# EAGLE schematic AirDistMotor (EAGLE 7.5.0)
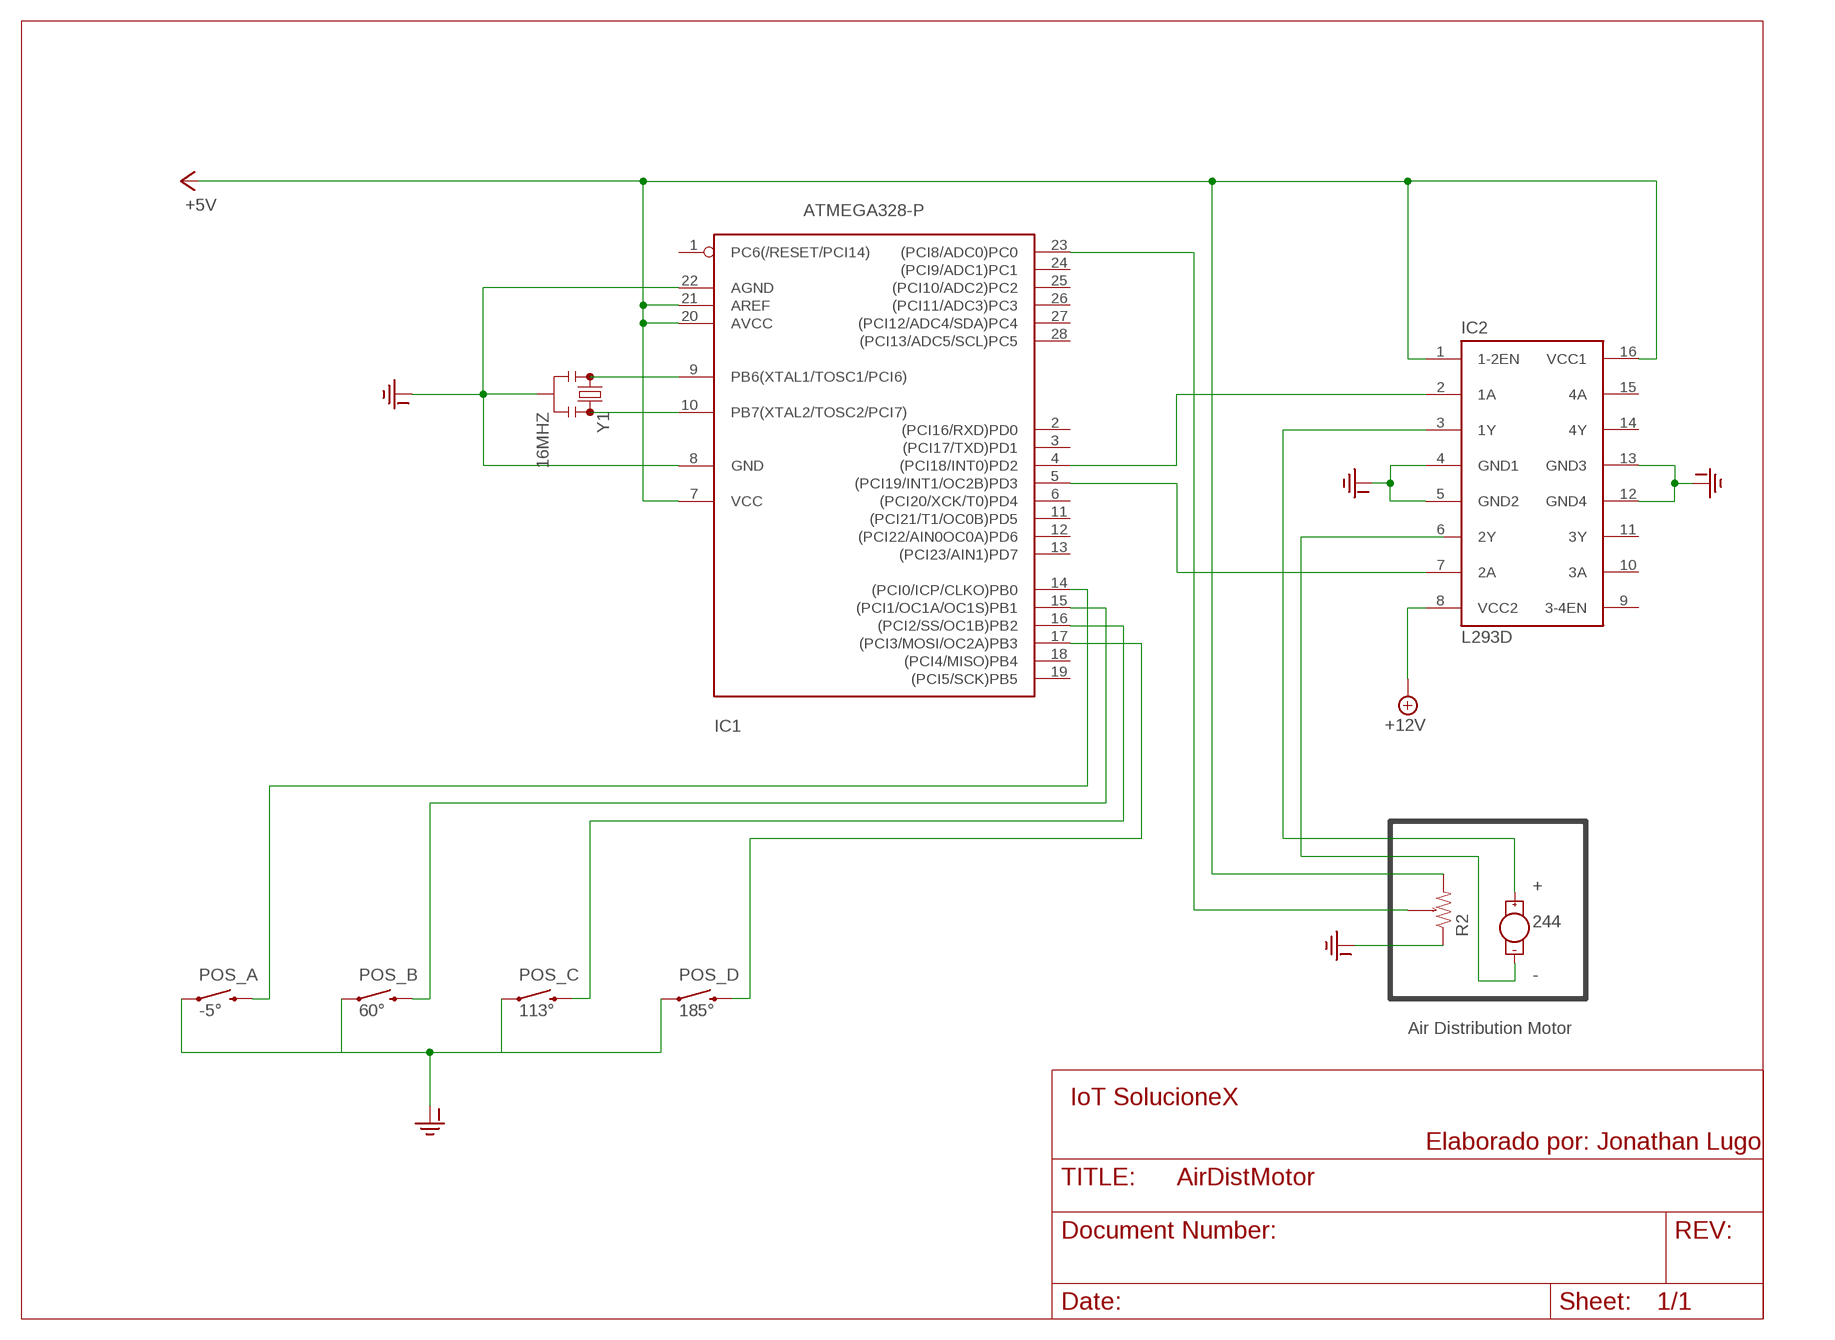
[diagram p0: schematic, sheet 1]

## Parts
244  MOTOR10MM  [VIBE-MOTOR-10MM]
IC1  ATMEGA328-P  ATMEGA328-20P  [DIL28-3]
IC2  L293D  [DIL16]
POS_A  -5°  SWITCH-MOMENTARY-2PTH  [TACTILE-PTH]
POS_B  60°  SWITCH-MOMENTARY-2PTH  [TACTILE-PTH]
POS_C  113°  SWITCH-MOMENTARY-2PTH  [TACTILE-PTH]
POS_D  185°  SWITCH-MOMENTARY-2PTH  [TACTILE-PTH]
R2  POTENTIOMETER  [0603-ARV]
Y1  16MHZ  RESONATOR16MHZ  [RESONATOR-SMD]

## Nets
+5V: IC1.7(VCC) IC1.20(AVCC) IC1.21(AREF) IC2.1(1-2EN) IC2.16(VCC1) R2.2
+12V: IC2.8(VCC2)
GND-ISO: IC1.8(GND) IC1.22(AGND) IC2.4(GND1) IC2.5(GND2) IC2.12(GND4) IC2.13(GND3) POS_A.1 POS_D.1 R2.1 Y1.2
N$1: 244.+ IC2.3(1Y)
N$2: IC1.23((PCI8/ADC0)PC0) R2.3 R2.4 R2.5 R2.6 R2.7 R2.8
N$3: IC1.9(PB6(XTAL1/TOSC1/PCI6)) Y1.1
N$4: IC1.10(PB7(XTAL2/TOSC2/PCI7)) Y1.3
N$5: 244.-
N$6: IC1.14((PCI0/ICP/CLKO)PB0) POS_A.3
N$7: IC1.15((PCI1/OC1A/OC1S)PB1) POS_B.3
N$8: IC1.16((PCI2/SS/OC1B)PB2) POS_C.3
N$9: IC1.17((PCI3/MOSI/OC2A)PB3) POS_D.3
N$10: POS_B.1
N$12: IC1.4((PCI18/INT0)PD2) IC2.2(1A)
N$13: IC1.5((PCI19/INT1/OC2B)PD3) IC2.7(2A)
N$15: POS_C.1
Unconnected: IC1.1(PC6(/RESET/PCI14)) IC1.2((PCI16/RXD)PD0) IC1.3((PCI17/TXD)PD1) IC1.6((PCI20/XCK/T0)PD4) IC1.11((PCI21/T1/OC0B)PD5) IC1.12((PCI22/AIN0OC0A)PD6) IC1.13((PCI23/AIN1)PD7) IC1.18((PCI4/MISO)PB4) IC1.19((PCI5/SCK)PB5) IC1.24((PCI9/ADC1)PC1) IC1.25((PCI10/ADC2)PC2) IC1.26((PCI11/ADC3)PC3) IC1.27((PCI12/ADC4/SDA)PC4) IC1.28((PCI13/ADC5/SCL)PC5) IC2.6(2Y) IC2.9(3-4EN) IC2.10(3A) IC2.11(3Y) IC2.14(4Y) IC2.15(4A)

## Notes on the sheet
- +
- -
- Air Distribution Motor
- IoT SolucioneX
- Elaborado por: Jonathan Lugo

## Library data of the parts
244 = SparkFun-Electromechanical:MOTOR: Vibration Motor- ROB-08449 Physical dimension and wire connections for this powerful vibration motor. Motor has a self adhesive backing.
IC1 = Atmel ATmega328:ATMEGA328*P: MICROCONTROLLER 32 kBytes FLASH 2 kBytes SRAM 1 kBytes EEPROM USART 8-channel 10 bit ADC
IC2 = st-microelectronics:L293D: PUSH-PULL 4 CHANNEL DRIVER; MPN: L293D; OC_FARNELL: 9589619; OC_NEWARK: 56P8249
POS_A POS_B POS_C POS_D = SparkFun-Electromechanical:SWITCH-MOMENTARY-2: Various NO switches- pushbuttons, reed, etc; PROD_ID: SWCH-08441
R2 = SparkFun-Passives:POTENTIOMETER
Y1 = SparkFun-FreqCtrl:RESONATOR: Resonator Small SMD resonator. Used, eg, on the Arduino Pro/ Pro Mini boards. 8MHz- XTAL-08895 16MHz- XTAL-08900; PROD_ID: XTAL-08900